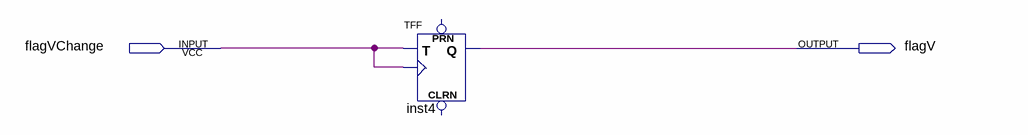
[diagram p0: schematic sheet]
// Quartus schematic flagReg.bdf as structural Verilog: 1 symbols, 2 pins
module flagReg (
  input  flagVChange,
  output flagV
);

  TFF inst4 (.T(flagVChange), .CLK(flagVChange), .Q(flagV));  // open: PRN, CLRN
endmodule
